# EAGLE design schematic (EAGLE 8.0.2)
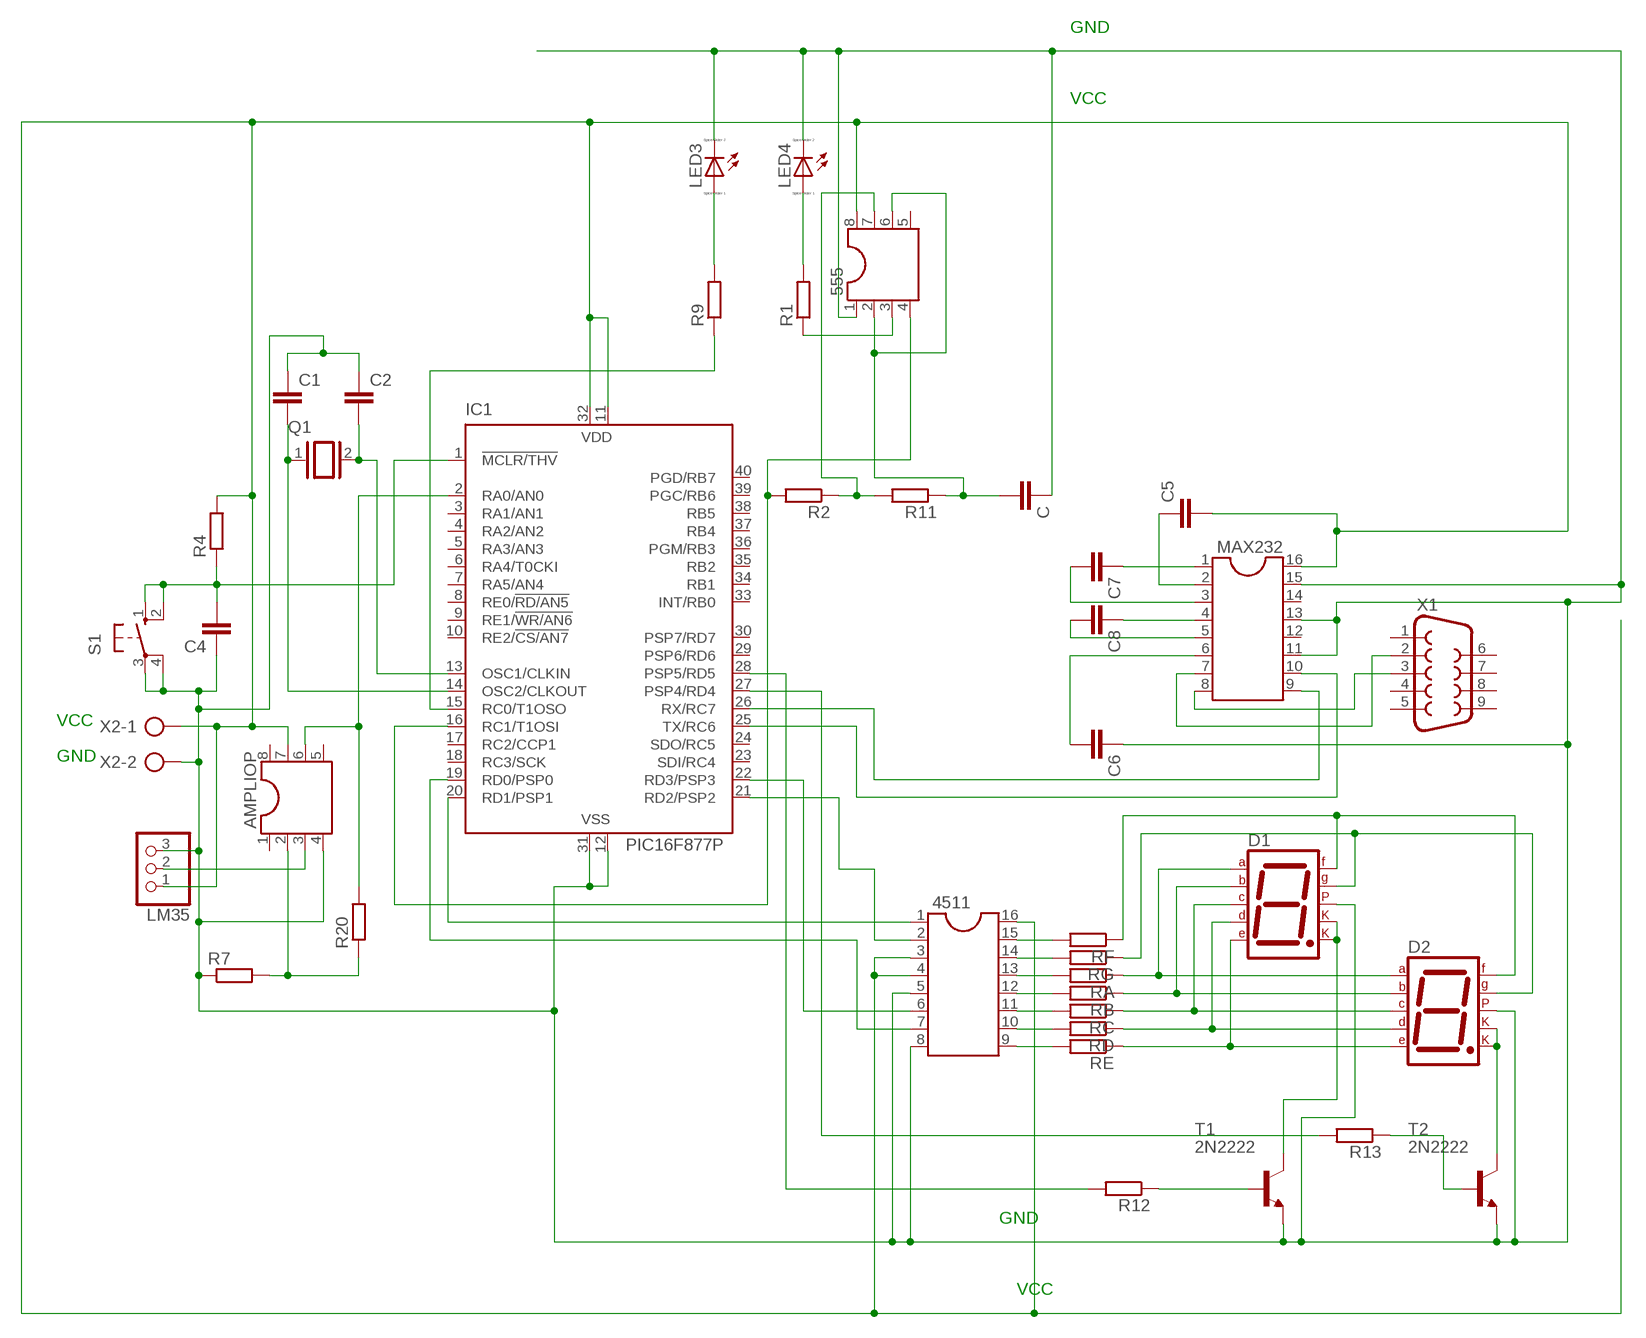
[diagram p0: schematic, sheet 1]

## Parts
555  DIL8  [DIL08]
4511  DIL16  [DIL16]
AMPLIOP  DIL8  [DIL08]
C  C-EU025-050X050  [C025-050X050]
C1  C-EU025-050X050  [C025-050X050]
C2  C-EU025-050X050  [C025-050X050]
C4  C-EU025-050X050  [C025-050X050]
C5  C-EU025-050X050  [C025-050X050]
C6  C-EU025-050X050  [C025-050X050]
C7  C-EU025-050X050  [C025-050X050]
C8  C-EU025-050X050  [C025-050X050]
D1  7SEG-CK  [7SEG-13]
D2  7SEG-CK  [7SEG-13]
IC1  PIC16F877P  [DIL40]
LED3  LED_ELD260  [LED_LD260]
LED4  LED_ELD260  [LED_LD260]
LM35  PINHD-1X3  [1X03]
MAX232  DIL16  [DIL16]
Q1  XTAL/S  [QS]
R1  R-EU_0204/7  [0204/7]
R2  R-EU_0204/7  [0204/7]
R4  R-EU_0204/7  [0204/7]
R7  R-EU_0204/7  [0204/7]
R9  R-EU_0204/7  [0204/7]
R11  R-EU_0204/7  [0204/7]
R12  R-EU_0204/7  [0204/7]
R13  R-EU_0204/7  [0204/7]
R20  R-EU_0204/7  [0204/7]
RA  R-EU_0204/7  [0204/7]
RB  R-EU_0204/7  [0204/7]
RC  R-EU_0204/7  [0204/7]
RD  R-EU_0204/7  [0204/7]
RE  R-EU_0204/7  [0204/7]
RF  R-EU_0204/7  [0204/7]
RG  R-EU_0204/7  [0204/7]
S1  10-XX  [B3F-10XX]
T1  2N2222  [TO18]
T2  2N2222  [TO18]
X1  F09V  [F09V]
X2  AK300/2  [AK300/2]

## Nets
GND: 555.1 4511.5 4511.8 AMPLIOP.4 C1.1 C2.1 C4.1 C6.1 C.1 D1.5(DP) D2.5(DP) IC1.12(VSS) IC1.31(VSS) LED3.K(C) LED4.K(C) LM35.3 MAX232.11 MAX232.13 MAX232.15 R7.1 S1.3(P) S1.4(P1) T1.1(E) T2.1(E) X2.2
N$1: IC1.27(PSP4/RD4) R13.2
N$2: C1.2 IC1.14(OSC2/CLKOUT) Q1.1
N$3: AMPLIOP.2 R7.2 R20.1
N$4: AMPLIOP.6 IC1.2(RA0/AN0) R20.2
N$5: AMPLIOP.3 LM35.2
N$6: LED4.A R1.2
N$7: C4.2 IC1.1(!MCLR/THV) R4.1 S1.1(S) S1.2(S1)
N$8: C2.2 IC1.13(OSC1/CLKIN) Q1.2
N$9: 4511.1 IC1.20(RD1/PSP1)
N$10: LED3.A R9.2
N$11: 555.3 R1.1
N$12: 555.2 555.6 C.2 R11.1
N$13: IC1.15(RC0/T1OSO) R9.1
N$14: 555.4 IC1.16(RC1/T1OSI) R2.2
N$15: MAX232.7 X1.2
N$16: MAX232.8 X1.3
N$17: C5.1 MAX232.2
N$18: C7.1 MAX232.1
N$19: C7.2 MAX232.3
N$20: C8.1 MAX232.4
N$21: C8.2 MAX232.5
N$22: C6.2 MAX232.6
N$23: IC1.25(TX/RC6) MAX232.10
N$24: IC1.26(RX/RC7) MAX232.9
N$25: 555.7 R2.1 R11.2
N$26: 4511.7 IC1.19(RD0/PSP0)
N$27: D1.3(CK1) D1.8(CK2) T1.3(C)
N$28: 4511.2 IC1.21(RD2/PSP2)
N$29: 4511.6 IC1.22(RD3/PSP3)
N$30: 4511.13 RA.2
N$31: IC1.28(PSP5/RD5) R12.2
N$32: 4511.12 RB.2
N$33: 4511.11 RC.2
N$34: 4511.10 RD.2
N$35: 4511.9 RE.2
N$36: D1.7(A) D2.7(A) RA.1
N$37: D1.2(D) D2.2(D) RD.1
N$38: D1.4(C) D2.4(C) RC.1
N$39: D1.1(E) D2.1(E) RE.1
N$41: 4511.15 RF.2
N$42: 4511.14 RG.2
N$44: D1.10(G) D2.10(G) RG.1
N$45: R12.1 T1.2(B)
N$46: 555.8 4511.3 4511.4 4511.16 AMPLIOP.7 C5.2 IC1.11(VDD) IC1.32(VDD) LM35.1 MAX232.16 R4.2 X2.1
N$47: D2.3(CK1) D2.8(CK2) T2.3(C)
N$48: R13.1 T2.2(B)
N$51: D1.6(B) D2.6(B) RB.1
N$53: D1.9(F) D2.9(F) RF.1
Unconnected: 555.5 AMPLIOP.1 AMPLIOP.5 AMPLIOP.8 IC1.3(RA1/AN1) IC1.4(RA2/AN2) IC1.5(RA3/AN3) IC1.6(RA4/T0CKI) IC1.7(RA5/AN4) IC1.8(RE0/!RD/AN5) IC1.9(RE1/!WR/AN6) IC1.10(RE2/!CS/AN7) IC1.17(RC2/CCP1) IC1.18(RC3/SCK) IC1.23(SDI/RC4) IC1.24(SDO/RC5) IC1.29(PSP6/RD6) IC1.30(PSP7/RD7) IC1.33(INT/RB0) IC1.34(RB1) IC1.35(RB2) IC1.36(PGM/RB3) IC1.37(RB4) IC1.38(RB5) IC1.39(PGC/RB6) IC1.40(PGD/RB7) MAX232.12 MAX232.14 X1.1 X1.4 X1.5 X1.6 X1.7 X1.8 X1.9

## Notes on the sheet
- GND
- VCC
- VCC
- GND
- GND
- VCC

## Library data of the parts
555 AMPLIOP = ic-package:DIL8: Dual In Line / Socket
4511 MAX232 = ic-package:DIL16: Dual In Line / Socket
C C1 C2 C4-C8 = rcl:C-EU: CAPACITOR, European symbol
D1 D2 = special:7SEG-CK: 7-segment DISPLAY single cathode, 13 mm
IC1 = microchip:PIC16F87*: MICROCONTROLLER; MF: MICROCHIP; MPN: PIC16F877-04/P; OC_FARNELL: 9761349; OC_NEWARK: 61K3463
LED3 LED4 = eagle-ltspice:LED_E: LED Source: http://www.osram.convergy.de Source: www.luxeon.com Source: www.kingbright.com; SPICEMODEL: NONE; SPICEPREFIX: D; SPICETYPE: diode
LM35 = pinhead:PINHD-1X3: PIN HEADER
Q1 = special:XTAL/S: CRYSTAL
R1 R2 R4 R7 R9 R11-R13 R20 RA RB RC RD RE RF RG = rcl:R-EU_: RESISTOR, European symbol
S1 = switch-omron:10-XX: OMRON SWITCH; MPN: B3F-1000; OC_FARNELL: 176432; OC_NEWARK: 36M3542
T1 T2 = transistor:2N2222: NPN TRANSISTOR
X1 = con-subd:F09: SUB-D; OC_FARNELL: unknown; OC_NEWARK: unknown
X2 = con-ptr500:AK300/2: CONNECTOR; OC_FARNELL: unknown; OC_NEWARK: unknown

## Board
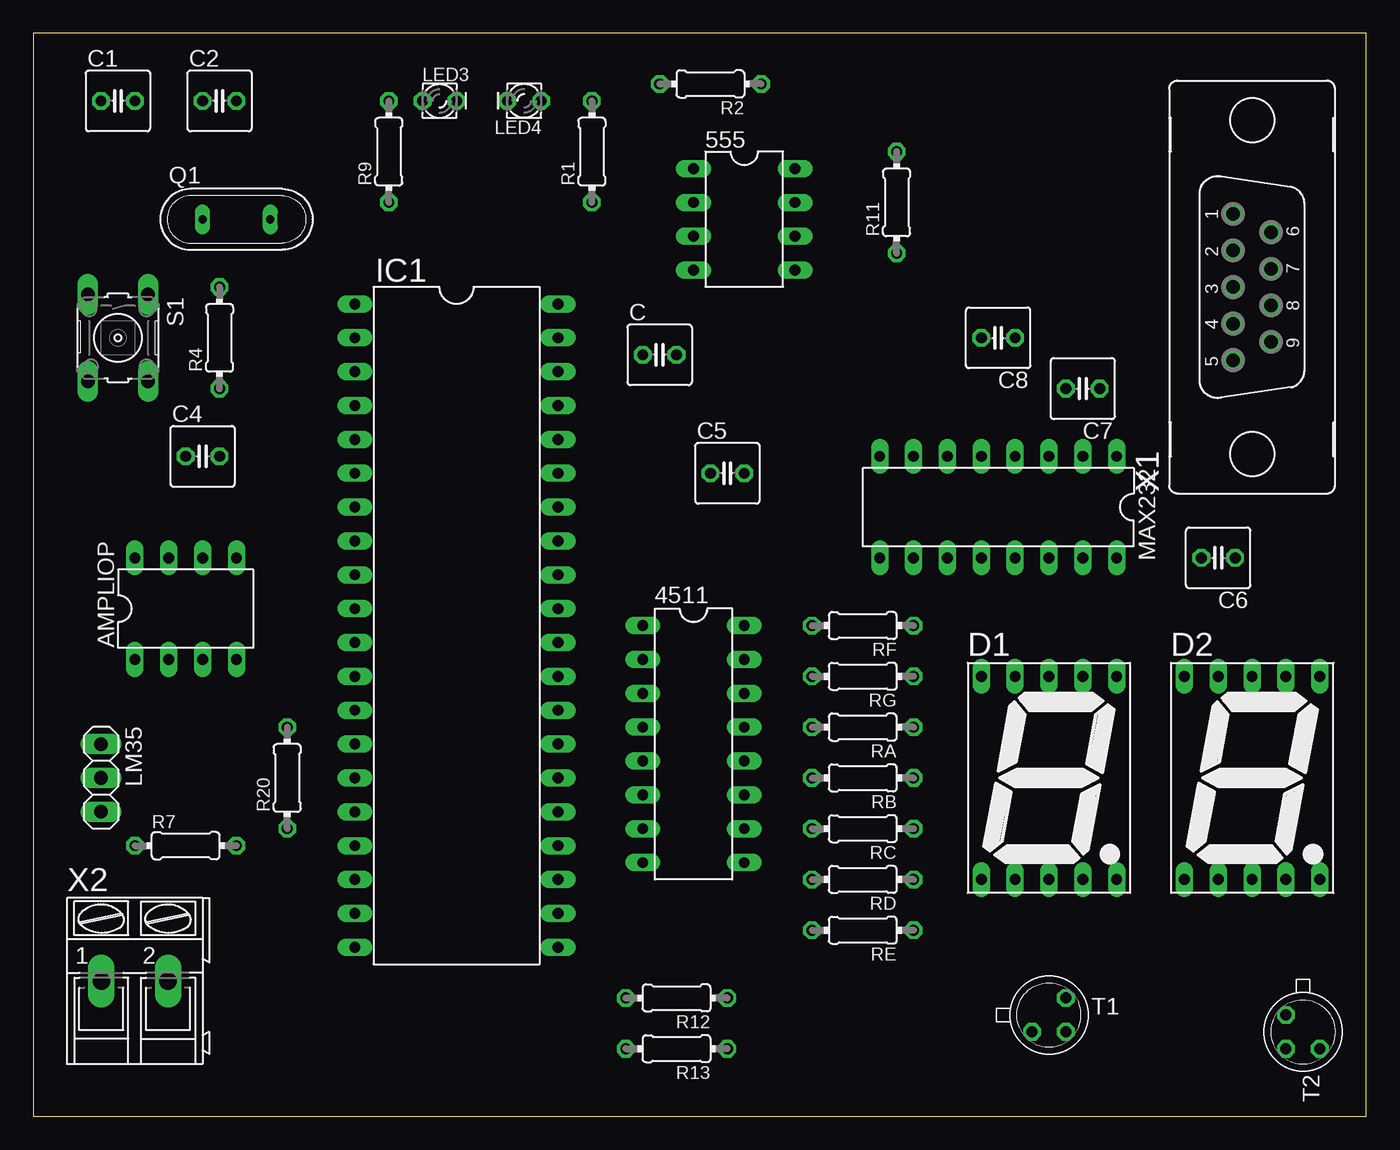
[diagram p1: board, top side]
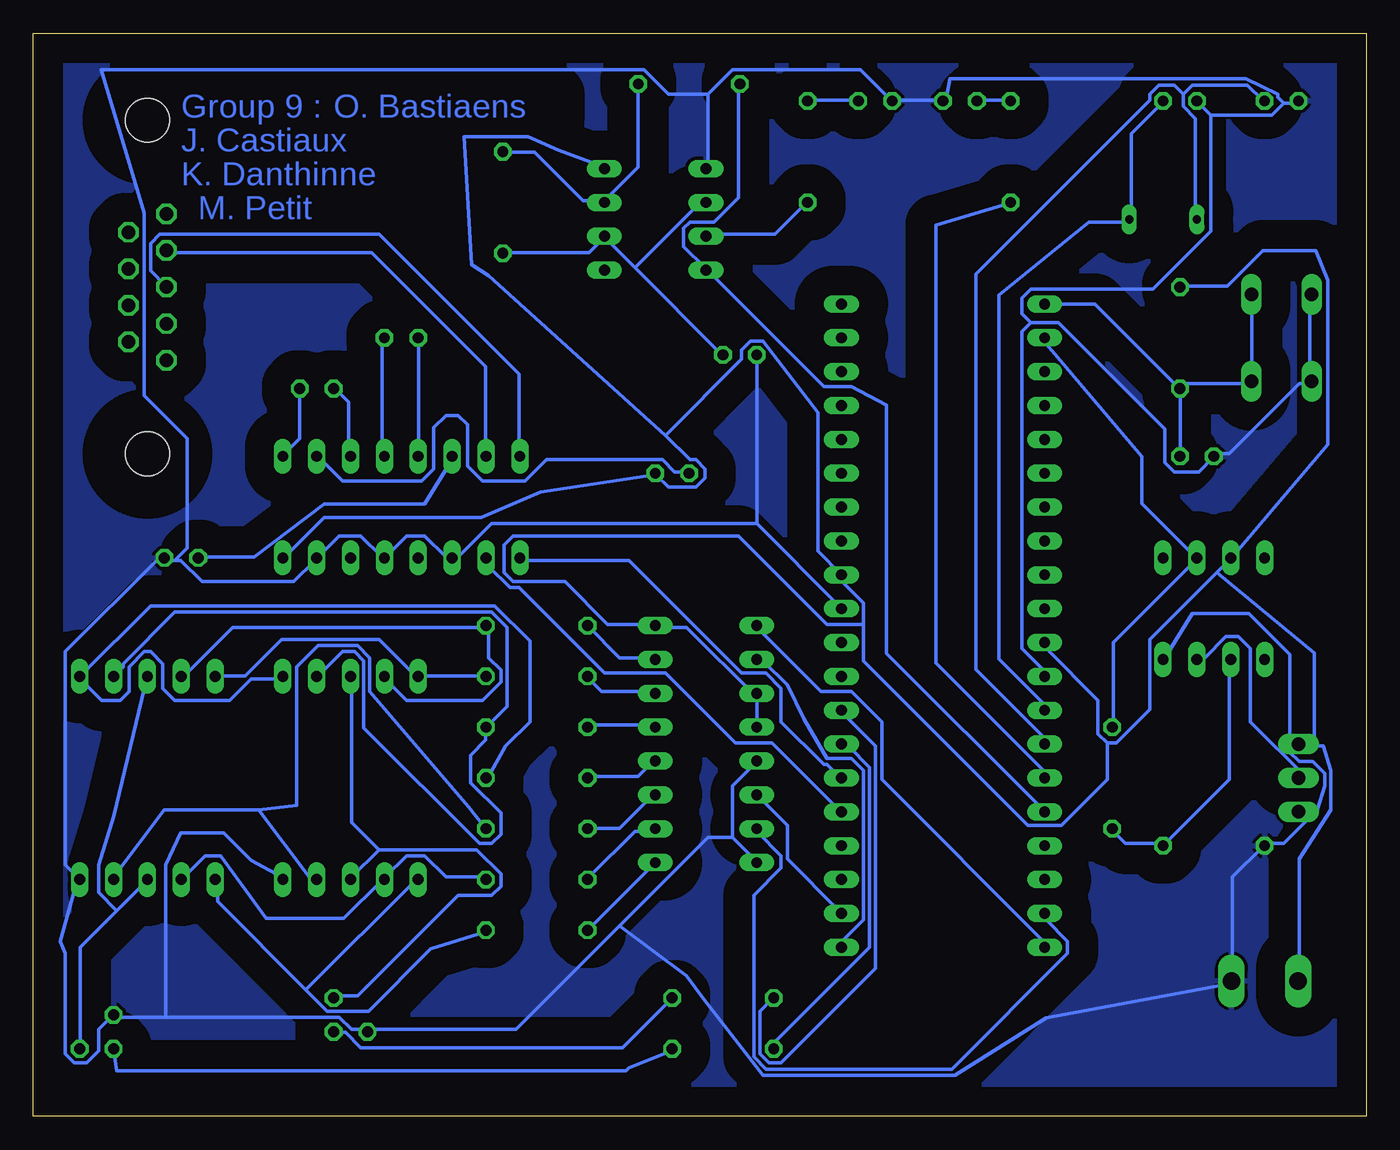
[diagram p2: board, bottom side, seen from below]

Size 100 x 81.27 mm. Coordinates in mm from the lower left corner, seen from the top.
Outline: 0,0 100,0 100,81.27 0,81.27 0,0
Copper layers (1*16): Top 0.035mm / dielectric 1.5mm / Bottom 0.035mm
Design rules "default": minimum track width 10mil, minimum drill 24mil, track to track 8mil, track to pad 8mil, pad to pad 8mil, via to via 8mil, smd to smd 8mil, copper to edge 40mil, drill to drill 8mil, minimum pad ring 10mil, minimum via ring 8mil, stop-mask expansion 4mil, vias tented up to drill 0mil, thermal gap 10mil

### Footprints (pad centres in the part's own frame; a part is rotated, then mirrored left to right if it is on the bottom)
DIL08 = drill 0.813 long: 1 -3.81,-3.81; 2 -1.27,-3.81; 3 1.27,-3.81; 4 3.81,-3.81; 5 3.81,3.81; 6 1.27,3.81; 7 -1.27,3.81; 8 -3.81,3.81
DIL16 = drill 0.813 long: 1 -8.89,-3.81; 2 -6.35,-3.81; 3 -3.81,-3.81; 4 -1.27,-3.81; 5 1.27,-3.81; 6 3.81,-3.81; 7 6.35,-3.81; 8 8.89,-3.81; 9 8.89,3.81; 10 6.35,3.81; 11 3.81,3.81; 12 1.27,3.81; 13 -1.27,3.81; 14 -3.81,3.81; 15 -6.35,3.81; 16 -8.89,3.81
C025-050X050 = drill 0.813 octagon: 1 -1.27,0; 2 1.27,0
7SEG-13 = drill 0.813 long: 1 -5.08,-7.62; 2 -2.54,-7.62; 3 0,-7.62; 4 2.54,-7.62; 5 5.08,-7.62; 6 5.08,7.62; 7 2.54,7.62; 8 0,7.62; 9 -2.54,7.62; 10 -5.08,7.62
DIL40 = drill 0.813 long: 1 -24.13,-7.62; 2 -21.59,-7.62; 3 -19.05,-7.62; 4 -16.51,-7.62; 5 -13.97,-7.62; 6 -11.43,-7.62; 7 -8.89,-7.62; 8 -6.35,-7.62; 9 -3.81,-7.62; 10 -1.27,-7.62; 11 1.27,-7.62; 12 3.81,-7.62; 13 6.35,-7.62; 14 8.89,-7.62; 15 11.43,-7.62; 16 13.97,-7.62; 17 16.51,-7.62; 18 19.05,-7.62; 19 21.59,-7.62; 20 24.13,-7.62; 21 24.13,7.62; 22 21.59,7.62; 23 19.05,7.62; 24 16.51,7.62; 25 13.97,7.62; 26 11.43,7.62; 27 8.89,7.62; 28 6.35,7.62; 29 3.81,7.62; 30 1.27,7.62; 31 -1.27,7.62; 32 -3.81,7.62; 33 -6.35,7.62; 34 -8.89,7.62; 35 -11.43,7.62; 36 -13.97,7.62; 37 -16.51,7.62; 38 -19.05,7.62; 39 -21.59,7.62; 40 -24.13,7.62
LED_LD260 = drill 0.813 octagon: A -1.27,0; K 1.27,0
1X03 = drill 1.016 long: 1 -2.54,0; 2 0,0; 3 2.54,0
QS = drill 0.61 long: 1 -2.54,0; 2 2.54,0
0204/7 = drill 0.813 octagon: 1 -3.81,0; 2 3.81,0
B3F-10XX = drill 1.016 long: 1 -3.251,2.261; 2 3.251,2.261; 3 -3.251,-2.261; 4 3.251,-2.261
TO18 = drill 0.813 octagon: 1 -1.27,-1.27; 2 1.27,-1.27; 3 1.27,1.27
F09V = drill 1.016 octagon: 1 5.486,1.422; 2 2.743,1.422; 3 0,1.422; 4 -2.743,1.422; 5 -5.486,1.422; 6 4.115,-1.422; 7 1.372,-1.422; 8 -1.372,-1.422; 9 -4.115,-1.422 | hole 3.302: -12.522,0; 12.522,0
AK300/2 = drill 1.321 long: 1 -2.515,0; 2 2.489,0

### Placement (x,y rotation side)
555  53.34,67.31 270 top
4511  49.53,27.94 270 top
AMPLIOP  11.43,38.1 0 top
C  46.99,57.15 0 top
C1  6.35,76.2 0 top
C2  13.97,76.2 0 top
C4  12.7,49.53 0 top
C5  52.07,48.26 0 top
C6  88.9,41.91 180 top
C7  78.74,54.61 180 top
C8  72.39,58.42 180 top
D1  76.2,25.4 0 top
D2  91.44,25.4 0 top
IC1  31.75,36.83 270 top
LED3  30.48,76.2 0 top
LED4  36.83,76.2 180 top
LM35  5.08,25.4 270 top
MAX232  72.39,45.72 180 top
Q1  15.24,67.31 0 top
R1  41.91,72.39 90 top
R2  50.8,77.47 180 top
R4  13.97,58.42 90 top
R7  11.43,20.32 0 top
R9  26.67,72.39 90 top
R11  64.77,68.58 90 top
R12  48.26,8.89 180 top
R13  48.26,5.08 180 top
R20  19.05,25.4 90 top
RA  62.23,29.21 180 top
RB  62.23,25.4 180 top
RC  62.23,21.59 180 top
RD  62.23,17.78 180 top
RE  62.23,13.97 180 top
RF  62.23,36.83 180 top
RG  62.23,33.02 180 top
S1  6.35,58.42 270 top
T1  76.2,7.62 0 top
T2  95.25,6.35 270 top
X1  91.44,62.23 90 top
X2  7.62,10.16 0 top

### Tracks (layer width: path | path; a pad name or v marks a point on that pad's centre or on a via)
GND
  Bottom 0.254: 6.17,76.02 5.26,76.02 C1.1 | 6.17,76.02 7.09,75.11 11.66,75.11 | 11.66,75.11 12.57,76.02 C2.1 | 49.38,76.71 49.38,71.22 555.1 | 49.38,76.71 47.55,78.54 37.95,78.54 35.66,76.25 LED4.K 35.43,76.25 31.77,76.25 LED3.K 31.55,76.25 31.22,77.85 9.04,77.85 6.63,76.71 6.63,76.48 6.17,76.02 | S1.3 4.24,61.62 4.24,55.22 S1.4 4.24,54.99 5.03,54.99 10.29,49.73 11.43,49.73 C4.1 11.43,49.51 12.57,48.36 14.4,48.36 15.09,49.05 15.09,51.56 23.09,59.56 25.15,59.56 | 25.15,59.56 25.83,58.88 25.83,35.1 24.23,33.5 24.23,33.05 IC1.12 | 11.66,75.11 11.66,66.42 16,62.08 25.15,62.08 25.83,61.39 25.83,60.25 25.15,59.56 | 68.58,41.96 69.04,41.96 70.64,43.56 72.01,43.56 MAX232.13 73.84,41.96 75.44,43.56 77.04,43.56 78.64,41.96 MAX232.15 78.87,41.73 80.47,40.13 87.33,40.13 88.92,41.73 89.38,41.73 | 89.38,41.73 90.07,41.73 C6.1 90.3,41.73 90.75,41.73 97.61,34.87 97.61,18.87 D2.5 96.7,17.73 97.97,13.16 97.61,12.24 97.61,4.7 96.93,4.01 96.01,4.01 95.1,4.93 95.1,6.53 94.18,7.44 T2.1 93.95,7.44 90.07,7.44 | 45.72,44.48 39.55,38.3 IC1.31 | C.1 45.72,44.48 | 68.58,41.96 68.12,41.96 65.61,44.48 45.72,44.48 | 68.58,41.96 MAX232.11 | AMPLIOP.4 15.09,34.42 13.03,37.74 8.81,37.74 5.71,34.65 5.71,27.33 5.03,26.64 4.01,26.64 3.1,25.73 3.1,24.82 3.66,22.99 LM35.3 3.89,22.76 6.17,20.47 7.54,20.47 R7.1 7.77,20.24 10.06,17.96 10.06,10.18 X2.2 10.29,9.96 24,7.42 30.86,3.1 45.26,3.1 49.71,8.81 50.98,10.54 56.01,14.3 | 47.55,20.93 45.72,19.1 4511.8 | 47.55,20.93 47.55,24.82 45.72,26.64 4511.5 | 90.07,7.44 77.04,7.44 76.12,6.53 74.98,6.53 T1.1 74.75,6.53 63.78,6.53 56.01,14.3 | 90.07,7.44 90.07,18.87 88.92,21.29 85.72,21.29 83.67,19.23 81.38,17.96 D1.5
  Bottom 0.254: 47.55,20.93 49.38,20.93 56.01,14.3 | 49.38,76.71 52.35,76.71 54.18,78.54 94.89,78.54 91.67,67.79 91.67,54.08 88.47,50.88 88.47,42.65 89.38,41.73
  pour Bottom (isolate 2.184): 1.27,80.01 99.06,80.01 99.06,78.74 99.06,30.48 99.06,1.27 1.27,1.27
N$1
  Bottom 0.254: R13.2 44.35,5.16 44.35,5.61 37.26,12.7 37.26,26.19 38.86,27.79 39.32,27.79 IC1.27
N$2
  Bottom 0.254: 13.72,76.71 13.72,75.79 12.8,74.88 12.8,67.33 Q1.1 | 13.72,76.71 13.03,77.39 8.91,77.39 7.77,76.25 C1.2 | 13.72,76.71 14.4,77.39 15.54,77.39 16.23,76.71 16.23,76.25 29.29,63.2 29.29,33.53 24.23,28.47 24.23,28.02 IC1.14
N$3
  Bottom 0.254: R20.1 18.97,21.39 18.06,20.47 15.32,20.47 R7.2 10.29,25.27 10.29,34.19 AMPLIOP.2
N$4
  Bottom 0.254: R20.2 18.97,29.39 18.97,35.56 12.8,41.73 AMPLIOP.6 12.8,41.96 16.82,45.97 16.82,49.51 24,57.96 24,58.42 IC1.2
N$5
  Bottom 0.254: AMPLIOP.3 12.57,34.42 12.12,34.42 10.52,36.02 9.6,36.02 8.69,35.1 8.69,29.62 4.57,25.5 5.16,25.5 LM35.2
N$6
  Bottom 0.254: LED4.A 38.18,76.25 41.83,76.25 R1.2
N$7
  Bottom 0.254: S1.1 8.59,61.62 8.59,55.22 S1.2 8.81,54.99 13.72,54.99 13.95,54.76 R4.1 | C4.2 13.95,49.73 13.95,54.53 R4.1 | IC1.1 24,60.94 20.34,60.94 14.17,54.76 R4.1
N$8
  Bottom 0.254: C2.2 15.32,76.02 17.6,73.74 17.6,67.33 Q1.2 17.83,67.11 20.8,67.11 27.56,61.62 27.56,34.32 24.23,30.99 24.23,30.53 IC1.13
N$9  (1 unrouted)
  Bottom 0.254: IC1.20 24.23,12.7 24.23,13.16 36.35,25.27 36.35,29.62 38.63,31.9 40.92,31.9 45.72,36.7 4511.1
N$10
  Bottom 0.254: R9.2 26.87,76.25 29.03,76.25 LED3.A
N$11
  Bottom 0.254: 555.3 49.38,66.19 44.35,66.19 42.06,68.48 R1.1
N$12
  Bottom 0.254: 57.15,65.96 54.86,63.68 | 54.86,63.68 48.46,57.28 C.2 | 57.15,65.96 58.29,64.82 64.69,64.82 R11.1 | 57.15,65.96 555.6 | 54.86,63.68 50.06,68.48 49.61,68.48 555.2
N$13
  Bottom 0.254: IC1.15 24.23,25.5 24.23,25.96 32.28,34.01 32.28,66.88 26.87,68.48 R9.1
N$14
  Bottom 0.254: IC1.16 24.23,22.99 35.99,34.75 35.99,53.39 38.63,54.76 40.69,54.76 49.38,63.45 555.4 49.61,63.68 51.21,65.28 51.21,66.65 50.75,67.11 48.92,67.11 47.09,68.94 47.09,77.39 R2.2
N$15
  Bottom 0.254: MAX232.7 66.06,49.73 66.06,56.26 74.62,64.82 89.84,64.82 X1.2
N$16
  Bottom 0.254: MAX232.8 63.55,49.73 63.55,55.7 74.04,66.19 90.53,66.19 91.21,65.51 91.21,63.45 90.07,62.31 X1.3
N$17
  Bottom 0.254: C5.1 50.98,48.36 51.89,48.36 52.81,49.28 61.49,49.28 63.09,47.68 66.29,47.68 67.44,48.82 67.44,51.92 68.12,52.6 69.04,52.6 69.95,51.69 69.95,48.59 70.87,47.68 76.81,47.68 78.64,49.51 MAX232.2
N$18
  Bottom 0.254: C7.1 80.01,50.88 81.15,49.73 MAX232.1
N$19
  Bottom 0.254: MAX232.3 76.35,49.73 76.35,53.62 77.27,54.53 C7.2
N$20
  Bottom 0.254: MAX232.4 73.84,49.73 73.84,58.42 C8.1
N$21
  Bottom 0.254: MAX232.5 71.09,49.73 71.09,58.42 C8.2
N$22
  Bottom 0.254: MAX232.6 68.58,49.28 70.64,45.95 78.18,45.95 83.44,41.96 87.55,41.96 C6.2
N$23
  Bottom 0.254: IC1.25 39.55,22.99 44.58,28.02 47.32,28.02 52.58,33.27 57.15,33.27 63.55,39.68 64.24,39.68 65.84,41.28 65.84,41.73 MAX232.10
N$24
  Bottom 0.254: IC1.26 39.55,25.5 40.46,26.42 40.69,26.42 43.89,29.62 43.89,32.13 45.03,33.27 46.86,33.27 55.32,41.73 63.32,41.73 MAX232.9
N$25
  Bottom 0.254: 57.15,68.71 54.63,71.22 54.63,77.39 R2.1 | 57.15,68.71 58.75,68.71 62.41,72.36 64.69,72.36 R11.2 | 57.15,68.71 555.7
N$26
  Bottom 0.254: IC1.19 24,15.21 24,14.76 22.4,13.16 22.4,12.24 31.09,3.56 45.03,3.56 45.95,4.47 45.95,16.59 43.89,18.64 43.89,19.56 45.72,21.39 4511.7
N$27
  Bottom 0.254: 74.07,20.02 66.75,20.02 64.92,18.19 64.92,17.27 65.61,16.59 68.12,16.59 75.67,9.04 77.27,9.04 T1.3 | 74.07,20.02 76.12,17.96 D1.3 | 74.07,20.02 76.12,22.07 76.12,32.82 D1.8
N$28
  Bottom 0.254: IC1.21 39.32,12.7 39.32,13.16 37.72,14.76 37.72,25.96 38.63,26.87 40.46,26.87 42.16,29.84 43.43,32.36 45.26,34.19 45.72,34.19 4511.2
N$29
  Bottom 0.254: 4511.6 43.43,21.84 43.43,19.33 39.55,15.44 IC1.22
N$30
  Bottom 0.254: 4511.13 53.49,29.39 58.29,29.39 RA.2
N$31
  Bottom 0.254: IC1.28 39.32,30.3 36.8,27.79 36.8,11.1 43.89,4.01 44.81,4.01 45.49,4.7 45.49,7.9 44.58,8.81 R12.2
N$32
  Bottom 0.254: RB.2 58.29,25.5 54.63,25.5 53.49,26.64 4511.12
N$33
  Bottom 0.254: RC.2 58.29,21.61 56.01,21.61 53.49,24.13 4511.11
N$34
  Bottom 0.254: 4511.10 53.49,21.39 54.86,21.39 58.29,17.96 RD.2
N$35
  Bottom 0.254: 4511.9 53.49,18.87 58.29,14.07 RE.2
N$36
  Bottom 0.254: D1.7 78.64,33.05 76.81,34.87 75.89,34.87 75.21,34.19 75.21,29.16 66.52,20.47 65.61,20.47 64.92,21.16 64.92,22.76 67.21,25.04 67.21,27.1 66.06,28.25 66.06,29.16 RA.1 65.84,29.39 64.47,30.76 64.47,36.7 65.61,37.85 89.38,37.85 93.27,33.96 93.27,33.73 D2.7
N$37
  Bottom 0.254: RD.1 66.06,17.96 69.04,17.96 70.64,19.56 72.01,19.56 73.61,17.96 D1.2 73.84,17.73 76.71,14.86 82.53,14.86 85.95,19.56 87.1,19.56 88.7,17.96 D2.2
N$38
  Bottom 0.254: 83.11,23.01 79.32,17.96 78.87,17.96 D1.4 | 83.11,23.01 90.17,23.01 93.95,17.96 D2.4 | 83.11,23.01 80.24,23.34 80.24,33.73 78.64,35.33 75.67,35.33 74.75,34.42 74.75,31.9 67.33,23.22 66.06,21.61 RC.1
N$39
  Bottom 0.254: 79.55,9.5 86.18,16.13 86.18,17.73 D2.1 | 79.55,9.5 77.95,7.9 74.85,7.9 70.18,12.57 66.06,13.84 RE.1 | 79.55,9.5 71.32,17.73 D1.1
N$41
  Bottom 0.254: RF.2 56.01,34.42 53.49,34.42 4511.15
N$42
  Bottom 0.254: 4511.14 53.49,31.9 57.38,31.9 58.29,32.82 RG.2
N$44
  Bottom 0.254: RG.1 66.06,33.05 71.09,33.05 D1.10 71.32,33.05 74.07,35.79 81.38,35.79 84.12,33.05 86.18,33.05 D2.10
N$45
  Bottom 0.254: T1.2 77.27,6.3 76.58,6.3 75.44,5.16 55.78,5.16 52.12,8.81 R12.1
N$46
  Bottom 0.254: MAX232.16 81.15,41.96 78.18,44.93 66.42,44.93 61.95,46.86 53.49,48.13 C5.2 53.26,48.13 52.35,47.22 50.29,47.22 49.61,47.9 49.61,48.59 50.29,49.28 50.75,49.28 52.58,51.11 | 52.58,51.11 65.84,63.09 67.11,63.93 67.69,73.51 62.87,73.51 60.58,72.49 57.15,71.22 555.8 | 45.72,31.45 4511.3 45.72,31.67 | 45.72,31.45 4511.4 | 45.72,31.45 50.98,36.7 53.26,36.7 4511.16 53.49,36.93 56.92,36.93 60.12,40.13 64.01,40.13 64.69,40.82 64.69,42.88 64.01,43.56 47.09,43.56 40.46,36.93 37.72,36.93 | 19.43,28.02 20.12,28.7 20.12,31.22 24,35.1 24,35.56 IC1.11 | 19.43,28.02 18.75,28.02 16.23,30.53 16.23,35.79 11.2,40.82 | 11.2,40.82 10.29,41.73 AMPLIOP.7 10.06,41.96 2.87,50.42 2.87,62.76 3.79,64.95 7.77,64.95 10.41,62.31 13.95,62.31 R4.2 | 37.72,36.93 37.72,34.19 25.38,21.84 22.86,21.84 19.43,25.27 19.43,28.02 | 37.72,36.93 37.72,38.53 39.32,40.13 39.32,40.59 IC1.32 41.15,42.42 41.15,52.81 45.26,58.19 46.18,58.19 46.86,57.51 46.86,56.82 52.58,51.11 | 11.2,40.82 3.89,34.77 3.89,28.02 LM35.1 3.66,27.79 3.2,27.79 2.64,25.96 2.64,22.99 5.03,19.33 5.03,10.18 X2.1
N$47
  Bottom 0.254: 93.73,15.44 91.44,17.73 D2.3 | 93.73,15.44 96.47,12.7 96.47,5.16 T2.3 | D2.8 93.98,22.53 95.1,18.87 95.1,16.82 93.73,15.44
N$48
  Bottom 0.254: R13.1 52.12,4.93 55.32,3.66 55.55,3.43 93.73,3.43 93.95,4.93 T2.2
N$51
  Bottom 0.254: RB.1 65.84,25.5 64.57,27.79 62.74,29.62 62.74,35.66 65.38,38.3 91.21,38.3 96.47,33.05 D2.6 96.47,32.82 94.87,31.22 93.5,31.22 92.81,31.9 92.81,33.73 91.67,34.87 91.21,34.87 90.3,33.96 90.3,32.13 89.38,31.22 85.27,31.22 83.67,32.82 81.38,32.82 D1.6
N$53
  Bottom 0.254: D1.9 73.61,32.82 72.01,31.22 66.29,31.22 64.92,32.59 64.92,33.5 65.84,34.42 65.84,36.7 RF.1 66.06,36.7 85.04,36.7 88.7,33.05 D2.9

### Text on the board
Bottom: O. Bastiaens | Group 9 : | J. Castiaux | K. Danthinne | M. Petit